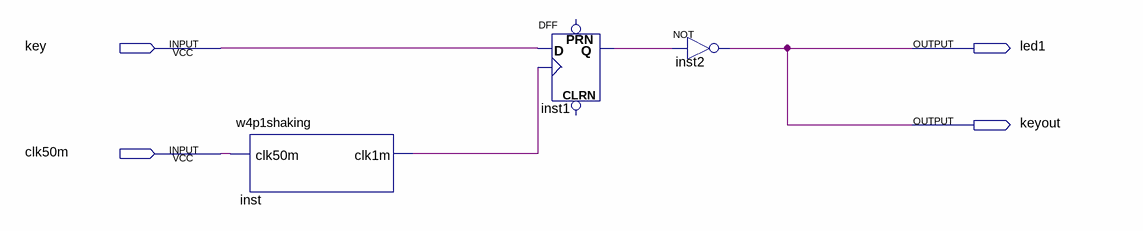
[diagram p0: schematic sheet]
// Quartus schematic Block1.bdf as structural Verilog: 3 symbols, 4 pins
module Block1 (
  input  key,
  input  clk50m,
  output led1,
  output keyout
);

  wire inst1_q, inst_clk1m;

  w4p1shaking inst (.clk50m(clk50m), .clk1m(inst_clk1m));
  DFF inst1 (.CLK(inst_clk1m), .D(key), .Q(inst1_q));  // open: CLRN, PRN
  not inst2 (keyout, inst1_q);

  assign led1 = keyout;
endmodule
